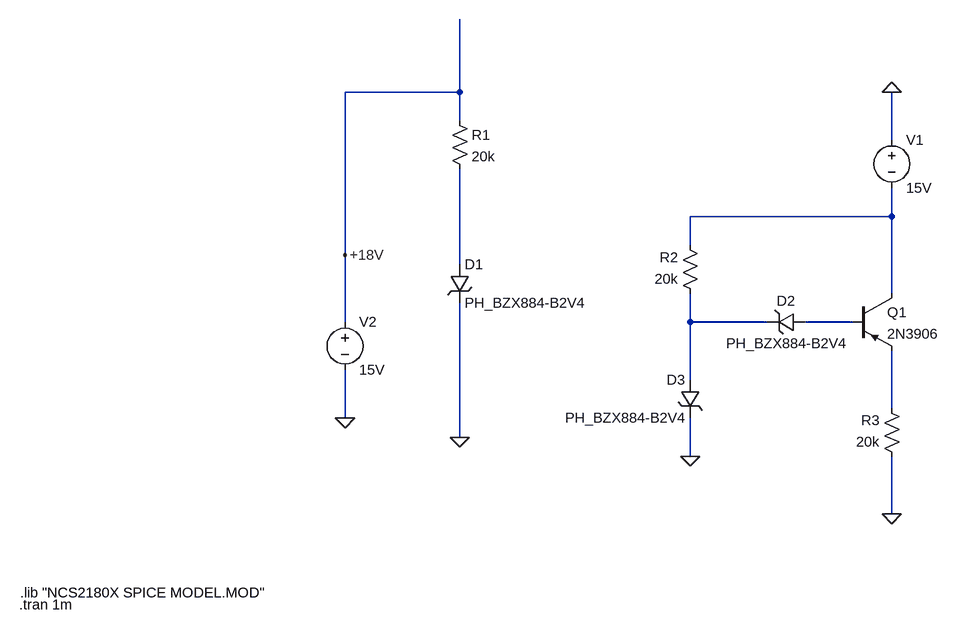
[diagram p0: schematic diode_check.asc]
diode_check.asc, the LTspice schematic file:
Version 4
SHEET 1 2884 680
WIRE 2000 -576 2000 -704
WIRE 2000 -576 1632 -576
WIRE 2000 -528 2000 -576
WIRE 2720 -496 2720 -576
WIRE 2720 -368 2720 -416
WIRE 2720 -368 2384 -368
WIRE 2384 -320 2384 -368
WIRE 1632 -304 1632 -576
WIRE 2000 -288 2000 -448
WIRE 2720 -240 2720 -368
WIRE 1632 -192 1632 -304
WIRE 2384 -192 2384 -240
WIRE 2512 -192 2384 -192
WIRE 2656 -192 2576 -192
WIRE 2384 -96 2384 -192
WIRE 2720 -48 2720 -144
WIRE 1632 -32 1632 -112
WIRE 2000 0 2000 -224
WIRE 2384 32 2384 -32
WIRE 2720 128 2720 32
FLAG 1632 -304 +18V
FLAG 1632 -32 0
FLAG 2000 0 0
FLAG 2720 -576 0
FLAG 2720 128 0
FLAG 2384 32 0
SYMBOL voltage 1632 -208 R0
WINDOW 123 0 0 Left 0
WINDOW 39 0 0 Left 0
SYMATTR InstName V2
SYMATTR Value 15V
SYMBOL zener 1984 -288 R0
SYMATTR InstName D1
SYMATTR Value PH_BZX884-B2V4
SYMATTR Description Diode
SYMATTR Type diode
SYMBOL res 1984 -544 R0
SYMATTR InstName R1
SYMATTR Value 20k
SYMBOL pnp 2656 -240 R0
SYMATTR InstName Q1
SYMATTR Value 2N3906
SYMBOL voltage 2720 -512 R0
WINDOW 123 0 0 Left 0
WINDOW 39 0 0 Left 0
SYMATTR InstName V1
SYMATTR Value 15V
SYMBOL res 2400 -224 R180
WINDOW 0 36 76 Left 2
WINDOW 3 36 40 Left 2
SYMATTR InstName R2
SYMATTR Value 20k
SYMBOL res 2736 48 R180
WINDOW 0 36 76 Left 2
WINDOW 3 36 40 Left 2
SYMATTR InstName R3
SYMATTR Value 20k
SYMBOL zener 2400 -96 M0
SYMATTR InstName D3
SYMATTR Value PH_BZX884-B2V4
SYMATTR Description Diode
SYMATTR Type diode
SYMBOL zener 2576 -208 R90
WINDOW 0 -4 32 VBottom 2
WINDOW 3 36 32 VTop 2
SYMATTR InstName D2
SYMATTR Value PH_BZX884-B2V4
SYMATTR Description Diode
SYMATTR Type diode
TEXT -544 344 Left 2 !.lib "NCS2180X SPICE MODEL.MOD"
TEXT -546 364 Left 2 !.tran 1m

The netlist it stands for:
* diode_check.asc
V2 +18V 0 15V
D1 N002 0 PH_BZX884-B2V4
R1 +18V N002 20k
Q1 N001 N004 N005 0 2N3906
V1 0 N001 15V
R2 N003 N001 20k
R3 0 N005 20k
D3 N003 0 PH_BZX884-B2V4
D2 N004 N003 PH_BZX884-B2V4
.model D D
.lib standard.dio
.model NPN NPN
.model PNP PNP
.lib standard.bjt
.lib "NCS2180X SPICE MODEL.MOD"
.tran 1m
.backanno
.end